# EAGLE design 12F629 (EAGLE 9.5.2)
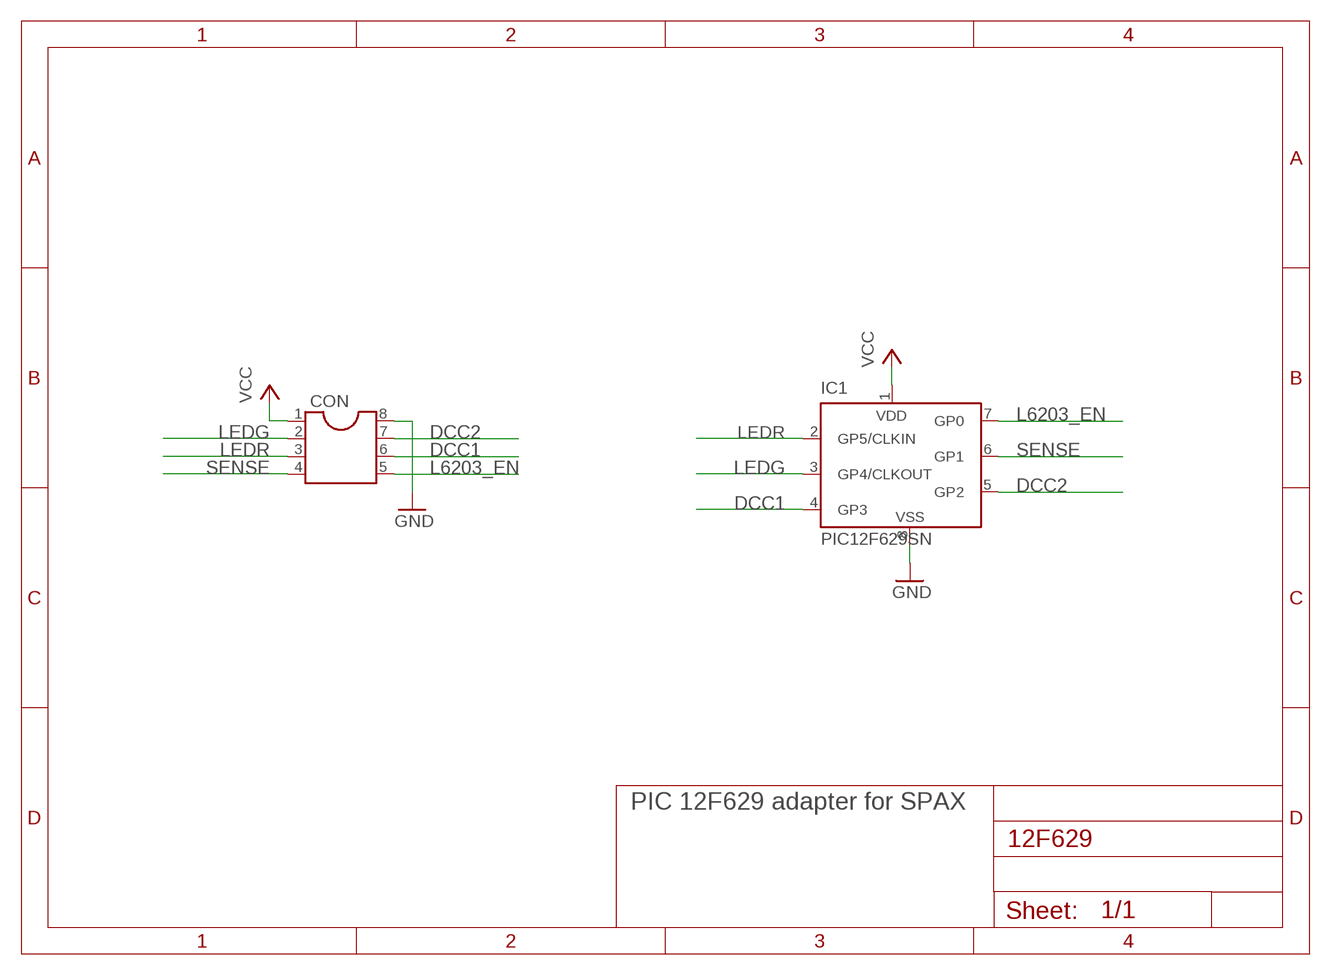
[diagram p0: schematic, sheet 1]

## Parts
CON  DIL8  [DIL08]
IC1  PIC12F629SN  [SO-08]

## Nets
DCC1: CON.6 IC1.4(GP3)
DCC2: CON.7 IC1.5(GP2)
GND: CON.8 IC1.8(VSS)
L6203_EN: CON.5 IC1.7(GP0)
LEDG: CON.2 IC1.3(GP4/CLKOUT)
LEDR: CON.3 IC1.2(GP5/CLKIN)
SENSE: CON.4 IC1.6(GP1)
VCC: CON.1 IC1.1(VDD)

## Notes on the sheet
- PIC 12F629 adapter for SPAX

## Library data of the parts
CON = ic-package-edited:DIL8: Dual In Line / Socket
IC1 = microchip:PIC12F6*: Data Sheet 8-Pin FLASH-Based 8-Bit CMOS Microcontrollers Source: http://www.microchip.com .. 41190c.pdf; MF: MICROCHIP; MPN: PIC12F629-I/SN; OC_FARNELL: 9759000; OC_NEWARK: 61K3433

## Net classes
0 default: width 0.305 mm, clearance 0.205 mm

## Board
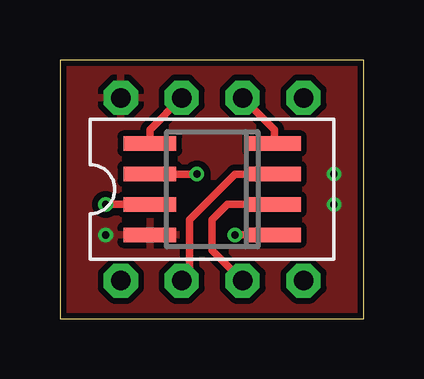
[diagram p1: board, top side]
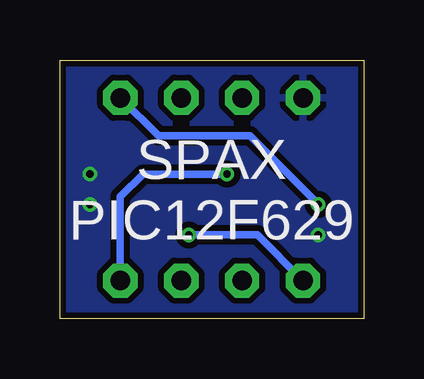
[diagram p2: board, bottom side, seen from below]

Size 12.68 x 10.78 mm. Coordinates in mm from the lower left corner, seen from the top.
Outline: 0,0 12.68,0 12.68,10.78 0,10.78 0,0
Copper layers (1*16): Top 0.035mm / dielectric 1.5mm / Bottom 0.035mm
Design rules "SeeedStudio_2layer_DRU_no_angle_20140221": minimum track width 6mil, minimum drill 12mil, track to track 6mil, track to pad 6mil, pad to pad 6mil, via to via 6mil, smd to smd 0mil, copper to edge 10mil, drill to drill 10mil, minimum pad ring 10mil, minimum via ring 6mil, stop-mask expansion 2mil, vias tented up to drill 100mil, thermal gap 10mil

### Footprints (pad centres in the part's own frame; a part is rotated, then mirrored left to right if it is on the bottom)
DIL08 = drill 0.813 pad 1.422 octagon: 1 -3.81,-3.81; 2 -1.27,-3.81; 3 1.27,-3.81; 4 3.81,-3.81; 5 3.81,3.81; 6 1.27,3.81; 7 -1.27,3.81; 8 -3.81,3.81
SO-08 = smd 0.6 x 2.2: 1 -1.905,-2.6; 2 -0.635,-2.6; 3 0.635,-2.6; 4 1.905,-2.6; 5 1.905,2.6; 6 0.635,2.6; 7 -0.635,2.6; 8 -1.905,2.6

### Placement (x,y rotation side)
CON  6.35,5.4 0 top
IC1  6.35,5.4 90 top

### Tracks (layer width: path | path; a pad name or v marks a point on that pad's centre or on a via)
DCC1
  Top 0.305: IC1.4 8.95,7.88 CON.6
DCC2
  Top 0.305: IC1.5 3.75,7.88 CON.7
GND  (via drill 0.3)
  other vias: 1.91,3.49 11.43,6.03 11.43,4.76
  pour Top (isolate 0.254): 0,0 0,10.79 12.7,10.79 12.7,0
  pour Bottom (isolate 0.254): 0,10.79 0,0 12.7,0 12.7,10.79
L6203_EN  (via drill 0.3)
  Top 0.305: IC1.7 v1.91,4.76
  Bottom 0.305: CON.5 8.57,7.62 4.76,7.62 v1.91,4.76
LEDG
  Top 0.305: CON.2 5.4,1.91 5.4,4.13 7.3,6.03 IC1.3
LEDR
  Top 0.305: CON.3 6.35,2.86 6.35,4.13 6.99,4.76 IC1.2
SENSE  (via drill 0.3)
  Top 0.305: v5.71,6.03 IC1.6
  Bottom 0.305: v5.71,6.03 9.21,6.03 10.16,5.08 CON.4
VCC  (via drill 0.3)
  Top 0.305: IC1.1 v7.3,3.49
  Bottom 0.305: v7.3,3.49 4.45,3.49 CON.1

### Text on the board
bNames: SPAX / PIC12F629